# Altium schematic sheet 05_Testpoints_Output.SchDoc
size A; SheetNumber: 5; SheetTotal: 6
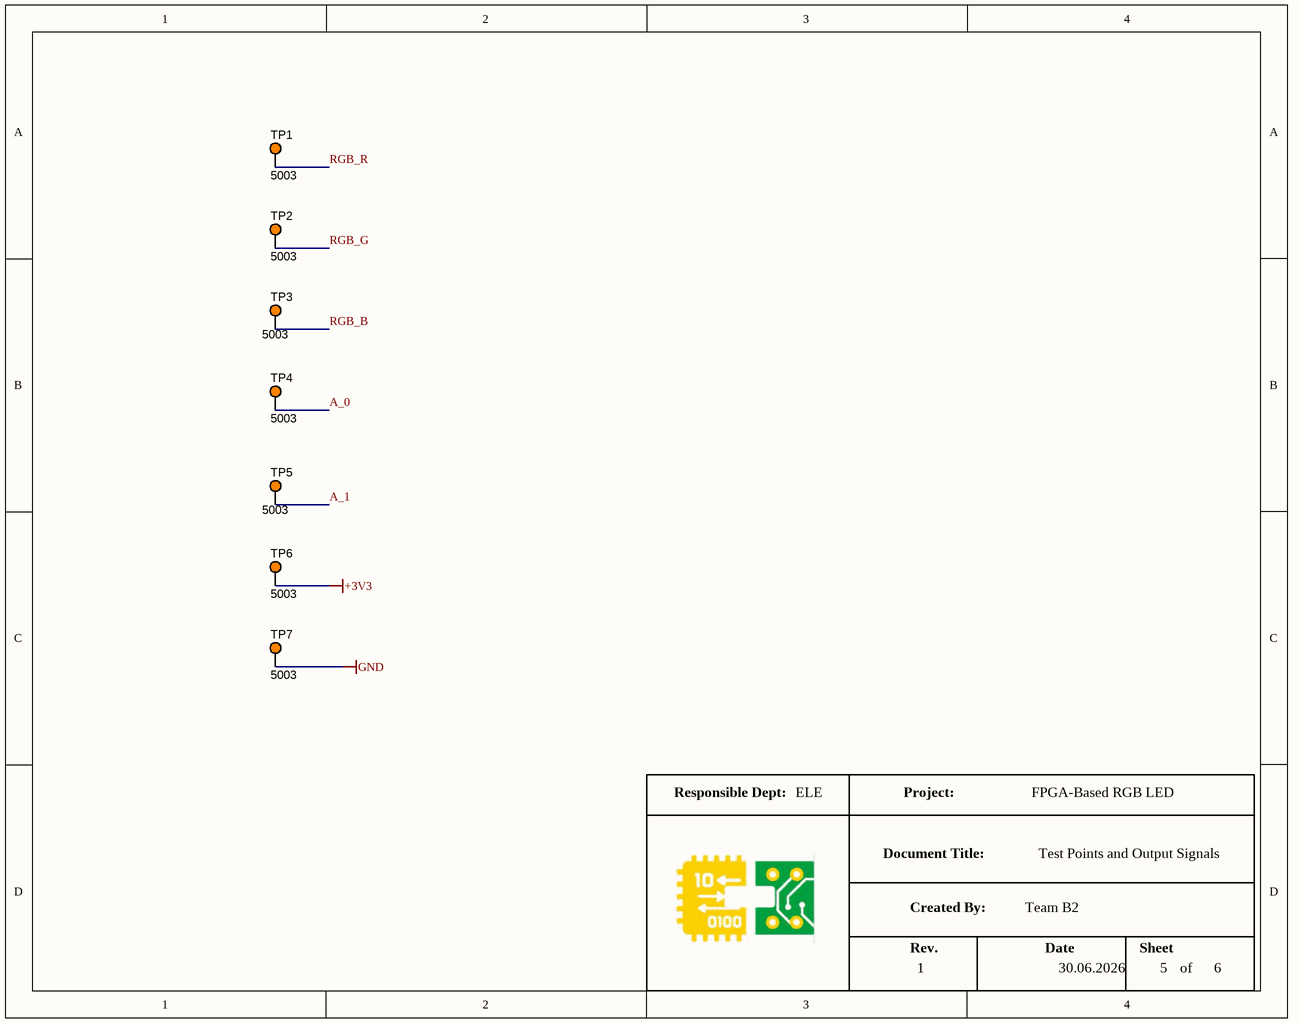
[diagram p0: 05_Testpoints_Output.SchDoc]

## Parts
TP1  5003  [KSTN-5003]
TP2  5003  [KSTN-5003]
TP3  5003  [KSTN-5003]
TP4  5003  [KSTN-5003]
TP5  5003  [KSTN-5003]
TP6  5003  [KSTN-5003]
TP7  5003  [KSTN-5003]

## Nets
+3V3: TP6.1
GND: TP7.1
A_0: TP4.1
A_1: TP5.1
RGB_B: TP3.1
RGB_G: TP2.1
RGB_R: TP1.1

## Notes on the sheet
- Responsible Dept:
- ELE
- Project:
- FPGA-Based RGB LED
- Document Title:
- Created By:
- Team B2
- Test Points and Output Signals
- Rev.
- 1
- Date
- 30.06.2026
- Sheet
- 5
- of
- 6

## Library data of the parts
TP1-TP7 = CMP-002-00037-2: Test Point, Orange, Height 4.6 mm, Tail Length 3 mm, 1-Pin THD, RoHS; Manufacturer: Keystone; Colour: Orange; Packaging: Bulk; Package Description: 1-Pin Through Hole Device, Dia 2.54 mm; Pins: 1; Package Reference: 5003; Datasheet Version: Jun-15; Case/Package: 5003; Mounting Technology: TH; Connector Type: TestPoint; Diameter: 2.54mm; Contact Material: Bronze; Datasheet URL: http://keyelco.com/userAssets/file/M65p56.pdf; Manufacturer URL: http://www.keyelco.com/; Package Quantity: 10; Contact Plating: Tin; RoHS Compliant: True